# Altium schematic sheet STM32 茶叶温湿度.SchDoc
size A4
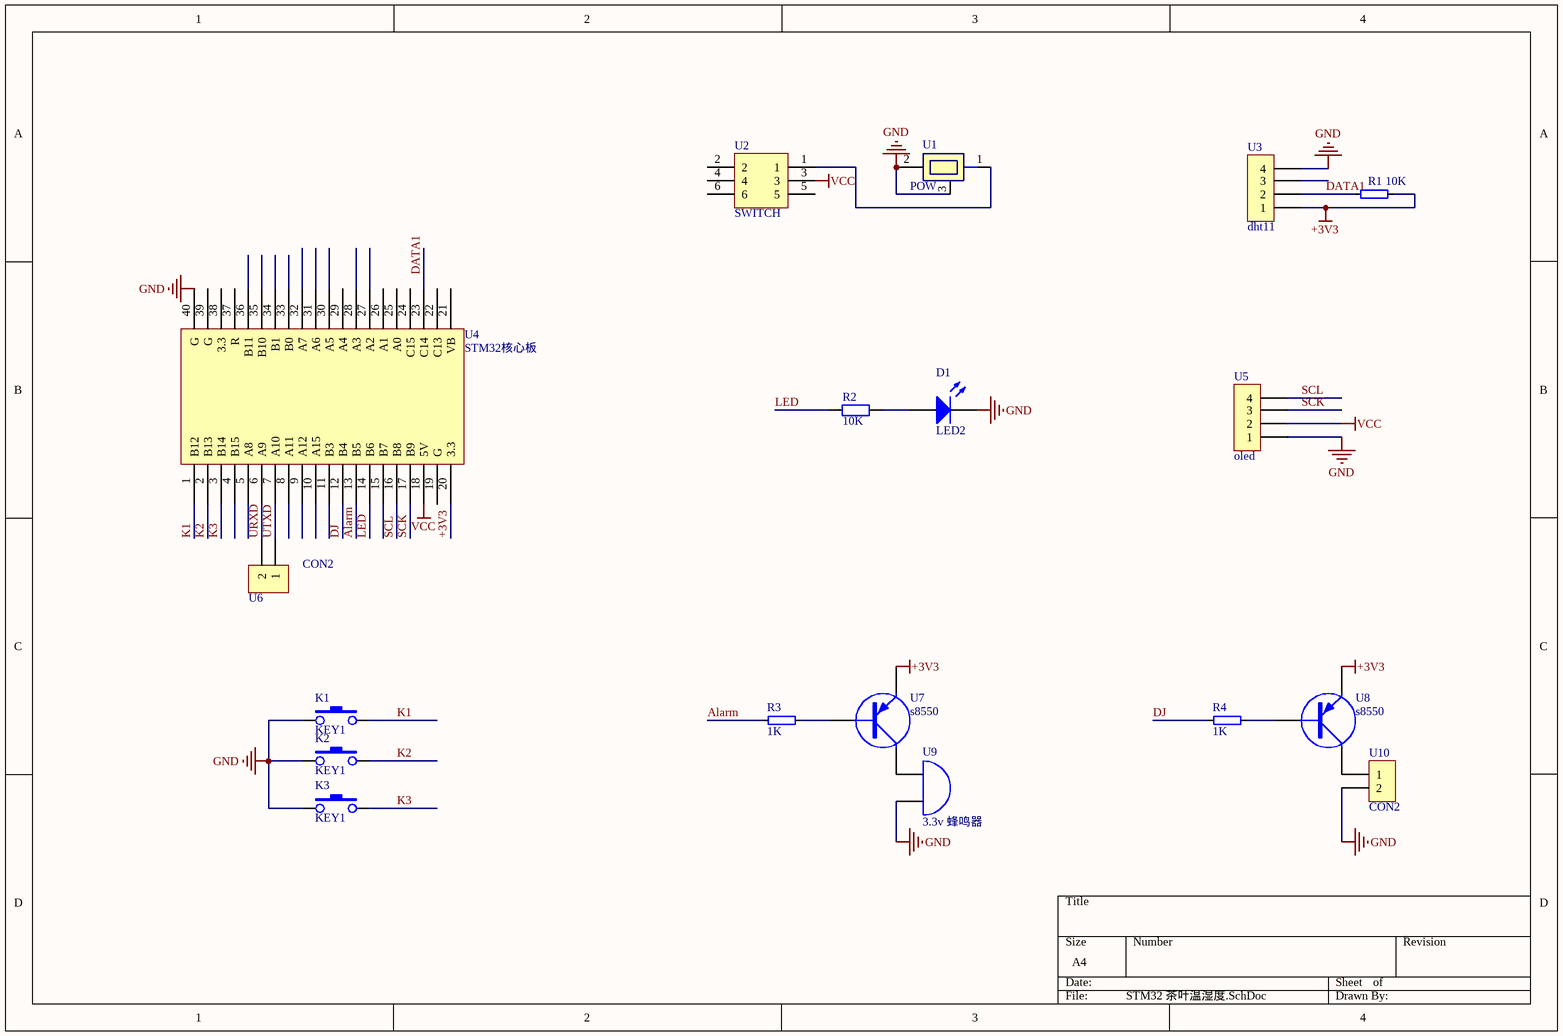
[diagram p0: STM32 茶叶温湿度.SchDoc]

## Parts
D1  LED2  [LED]
K1  KEY1  [KEY1]
K2  KEY1  [KEY1]
K3  KEY1  [KEY1]
R1  10K  [R-DIP]
R2  value 10K  [R-DIP]  (hidden comment: 1K)
R3  1K  [R-DIP]
R4  1K  [R-DIP]
U1  POW  [DCM]
U2  SWITCH  [KG1]
U3  dht11  [HDR1X4]
U4  STM32核心板  [STC]
U5  oled  [HDR1X4]
U6  CON2  [SIP2]
U7  s8550  [PNP]
U8  s8550  [PNP]
U9  3.3v 蜂鸣器  [BEEP]
U10  CON2  [SIP2]

## Nets
+3V3: R1.1 U3.1 U4.20(3.3) U7.2(E) U8.2(E)
GND: D1.2(K) K1.1 K2.1 K3.1 U1.2 U1.3 U3.4 U4.40(G) U5.1 U9.2(B) U10.2
VCC: U2.3 U4.18(5V) U5.2
Alarm: R3.1 U4.13(B5)
DATA1: R1.2 U3.2 U4.23(C14)
DJ: R4.1 U4.12(B4)
K1: K1.2 U4.1(B12)
K2: K2.2 U4.2(B13)
K3: K3.2 U4.3(B14)
LED: R2.2 U4.14(B6)
SCK: U4.17(B9) U5.3
SCL: U4.16(B8) U5.4
URXD: U4.6(A9) U6.2
UTXD: U4.7(A10) U6.1
NetD1_1: D1.1(A) R2.1
NetR3_2: R3.2 U7.1(B)
NetR4_2: R4.2 U8.1(B)
NetU1_1: U1.1 U2.1
NetU7_3: U7.3(C) U9.1(A)
NetU8_3: U8.3(C) U10.1

Not connected (* = marked no-connect by the designer): U2 2 4 5 6; U3 3; U4 4(B15) 5(A8) 8(A11) 9(A12) 10(A15) 11(B3) 15(B7) 19(G) 21(VB) 22(C13) 24(C15) 25(A0) 26(A1) 27(A2) 28(A3) 29(A4) 30(A5) 31(A6) 32(A7) 33(B0) 34(B1) 35(B10) 36(B11) 37(R) 38(3.3) 39(G)

## Library data of the parts
D1 = LED2: Typical RED, GREEN, YELLOW, AMBER GaAs LED; Published: 8-Jun-2000; LatestRevisionDate: 17-Jul-2002; LatestRevisionNote: Re-released for DXP Platform.; PackageVersion: Feb-2002; PackageReference: 3.2X1.6X1.1; Publisher: Altium Limited
R2 = Res2: Resistor; Published: 8-Jun-2000; LatestRevisionDate: 17-Jul-2002; LatestRevisionNote: Re-released for DXP Platform.; PackageReference: AXIAL-0.4; Publisher: Altium Limited
U3 U5 = CON4
U7 U8 = PNP
U9 = BELL